# Altium project Mode_V1.PrjPcb
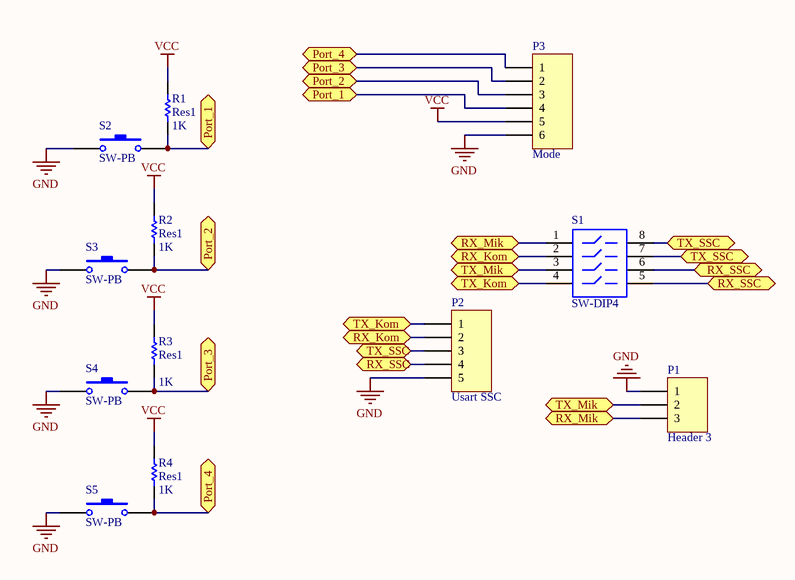
[diagram p0: Mode_V1.SchDoc]
1 sheet, 12 parts. Net scope: flat (ports and power ports of the same name join across sheets).
Board file: Mode_V1.PcbDoc

## Sheet Mode_V1.SchDoc
size A

### Parts
P1  Header 3  [HDR1X3]
P2  Usart SSC  [HDR1X5]
P3  Mode  [HDR1X6]
R1  Res1  value 1K  [AXIAL-0.3]
R2  Res1  value 1K  [AXIAL-0.3]
R3  Res1  value 1K  [AXIAL-0.3]
R4  Res1  value 1K  [AXIAL-0.3]
S1  SW-DIP4  [DIP-8]
S2  SW-PB  [SPST-2]
S3  SW-PB  [SPST-2]
S4  SW-PB  [SPST-2]
S5  SW-PB  [SPST-2]

### Ports
Port_1, Port_2, Port_3, Port_4, RX_Kom, RX_Mik, RX_SSC, TX_Kom, TX_Mik, TX_SSC

### Nets
GND: P1.1 P2.5 P3.6 S2.1 S3.1 S4.1 S5.1
VCC: P3.5 R1.2 R2.2 R3.2 R4.2
NetP1_2: P1.2 S1.3 ; port TX_Mik
NetP1_3: P1.3 S1.1 ; port RX_Mik
NetP2_1: P2.1 S1.4 ; port TX_Kom
NetP2_2: P2.2 S1.2 ; port RX_Kom
NetP2_3: P2.3 S1.7 S1.8 ; port TX_SSC
NetP2_4: P2.4 S1.5 S1.6 ; port RX_SSC
NetP3_1: P3.1 R4.1 S5.2 ; port Port_4
NetP3_2: P3.2 R3.1 S4.2 ; port Port_3
NetP3_3: P3.3 R2.1 S3.2 ; port Port_2
NetP3_4: P3.4 R1.1 S2.2 ; port Port_1

### Library data of the parts
P1 = Header 3: Header, 3-Pin; LatestRevisionDate: 17-Jul-2002; LatestRevisionNote: Re-released for DXP Platform.; Publisher: Altium Limited
P2 = Header 5: Header, 5-Pin; LatestRevisionDate: 17-Jul-2002; LatestRevisionNote: Re-released for DXP Platform.; Publisher: Altium Limited
P3 = Header 6: Header, 6-Pin; LatestRevisionDate: 17-Jul-2002; LatestRevisionNote: Re-released for DXP Platform.; Publisher: Altium Limited
R1-R4 = Res1: Resistor; Published: 8-Jun-2000; LatestRevisionDate: 17-Jul-2002; LatestRevisionNote: Re-released for DXP Platform.; PackageReference: AXIAL-0.3; Publisher: Altium Limited
S1 = SW-DIP4: DIP Switch; Published: 24-Mar-1999; LatestRevisionDate: 17-Jul-2002; LatestRevisionNote: Re-released for DXP Platform.; PackageReference: DIP-8; Publisher: Altium Limited
S2-S5 = SW-PB: Switch; Published: 24-Mar-1999; LatestRevisionDate: 17-Jul-2002; LatestRevisionNote: Re-released for DXP Platform.; PackageReference: SPST-2; Publisher: Altium Limited